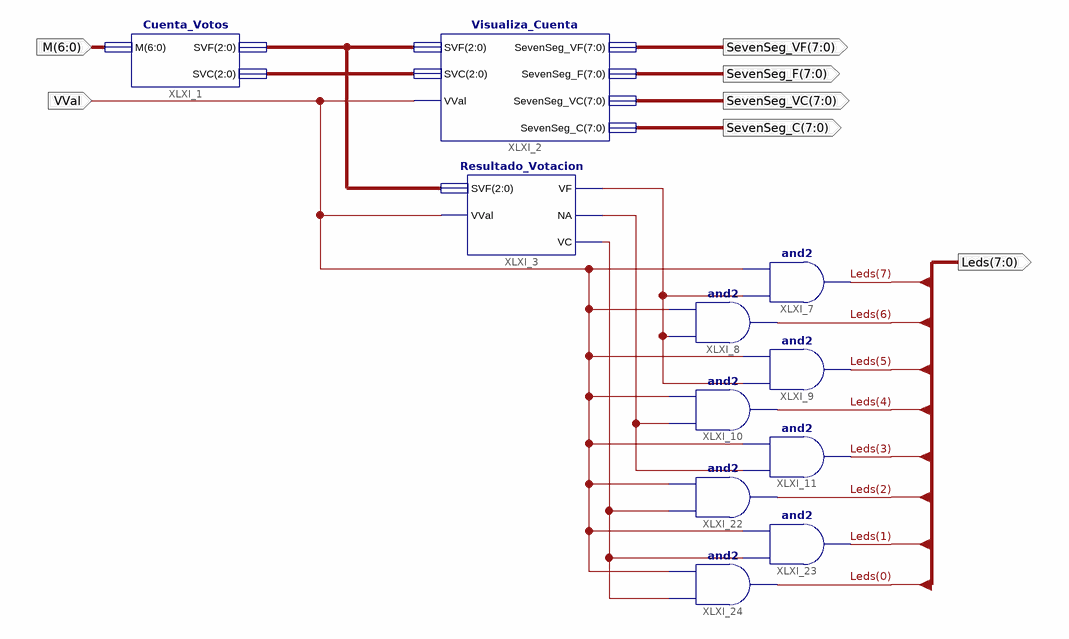
[diagram p0: schematic sheet 1]
// Xilinx ISE schematic Votacion.sch (spartan6) as structural Verilog: 11 symbols, 7 ports
module Votacion (
  input  [6:0] M,
  input  VVal,
  output [7:0] SevenSeg_VF,
  output [7:0] SevenSeg_F,
  output [7:0] SevenSeg_VC,
  output [7:0] SevenSeg_C,
  output [7:0] Leds
);

  wire XLXN_15, XLXN_17, XLXN_18;
  wire [2:0] XLXN_4, XLXN_5;

  Cuenta_Votos XLXI_1 (.M(M), .SVF(XLXN_5), .SVC(XLXN_4));
  Visualiza_Cuenta XLXI_2 (
    .SevenSeg_C(SevenSeg_C), .SevenSeg_F(SevenSeg_F), .SevenSeg_VC(SevenSeg_VC), .SevenSeg_VF(SevenSeg_VF),
    .SVC(XLXN_4), .SVF(XLXN_5), .VVal(VVal));
  Resultado_Votacion XLXI_3 (.NA(XLXN_17), .SVF(XLXN_5), .VC(XLXN_18), .VF(XLXN_15), .VVal(VVal));
  and XLXI_7 (Leds[7], XLXN_15, VVal);
  and XLXI_8 (Leds[6], XLXN_15, VVal);
  and XLXI_9 (Leds[5], XLXN_15, VVal);
  and XLXI_10 (Leds[4], XLXN_17, VVal);
  and XLXI_11 (Leds[3], XLXN_17, VVal);
  and XLXI_22 (Leds[2], XLXN_18, VVal);
  and XLXI_23 (Leds[1], XLXN_18, VVal);
  and XLXI_24 (Leds[0], XLXN_18, VVal);
endmodule
